# EAGLE design ライン_右 (EAGLE 9.6.2)
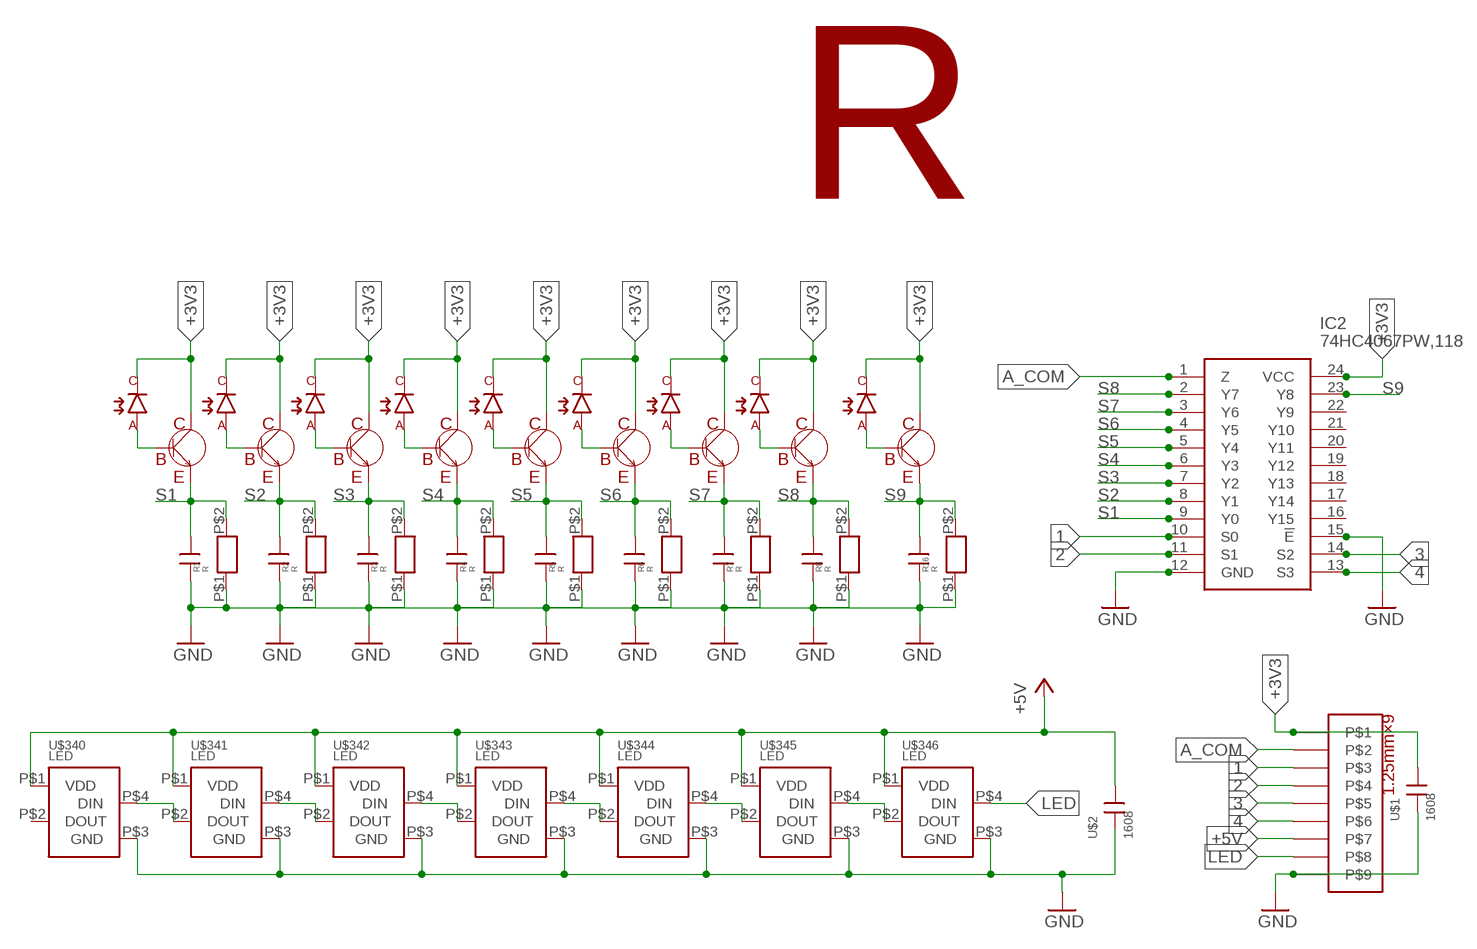
[diagram p0: schematic, sheet 1]

## Parts
C1  1608  [CON]
C2  1608  [CON]
C3  1608  [CON]
C4  1608  [CON]
C5  1608  [CON]
C6  1608  [CON]
C7  1608  [CON]
C8  1608  [CON]
C16  1608  [CON]
IC2  74HC4067PW,118  [SOP65P640X110-24N]
R1  R  [1608]
R2  R  [1608]
R3  R  [1608]
R4  R  [1608]
R5  R  [1608]
R6  R  [1608]
R7  R  [1608]
R8  R  [1608]
R16  R  [1608]
U$1  1608  [CON]
U$2  1608  [CON]
U$3  2CS2712  [TRANS_SSM3J325F,LF]
U$4  1MMCON  [1MMCON]
U$5  フォトダイオード  [フォトダイオード]
U$6  2CS2712  [TRANS_SSM3J325F,LF]
U$7  フォトダイオード  [フォトダイオード]
U$8  2CS2712  [TRANS_SSM3J325F,LF]
U$9  フォトダイオード  [フォトダイオード]
U$10  2CS2712  [TRANS_SSM3J325F,LF]
U$11  フォトダイオード  [フォトダイオード]
U$12  2CS2712  [TRANS_SSM3J325F,LF]
U$13  フォトダイオード  [フォトダイオード]
U$14  2CS2712  [TRANS_SSM3J325F,LF]
U$15  フォトダイオード  [フォトダイオード]
U$16  2CS2712  [TRANS_SSM3J325F,LF]
U$17  フォトダイオード  [フォトダイオード]
U$18  2CS2712  [TRANS_SSM3J325F,LF]
U$19  フォトダイオード  [フォトダイオード]
U$20  2CS2712  [TRANS_SSM3J325F,LF]
U$21  フォトダイオード  [フォトダイオード]
U$340  LED  [LED]
U$341  LED  [LED]
U$342  LED  [LED]
U$343  LED  [LED]
U$344  LED  [LED]
U$345  LED  [LED]
U$346  LED  [LED]

## Nets
1: IC2.10(S0) U$4.P$3
2: IC2.11(S1) U$4.P$4
3: IC2.14(S2) U$4.P$5
4: IC2.13(S3) U$4.P$6
+3V3 [New Class]: IC2.24(VCC) U$1.P$1 U$3.C U$4.P$1 U$5.C U$6.C U$7.C U$8.C U$9.C U$10.C U$11.C U$12.C U$13.C U$14.C U$15.C U$16.C U$17.C U$18.C U$19.C U$20.C U$21.C
+5V [New Class]: U$2.P$1 U$4.P$7 U$340.P$1(VDD) U$341.P$1(VDD) U$342.P$1(VDD) U$343.P$1(VDD) U$344.P$1(VDD) U$345.P$1(VDD) U$346.P$1(VDD)
A_COM: IC2.1(Z) U$4.P$2
GND [New Class]: C1.P$2 C2.P$2 C3.P$2 C4.P$2 C5.P$2 C6.P$2 C7.P$2 C8.P$2 C16.P$2 IC2.12(GND) IC2.15(!E) R1.P$1 R2.P$1 R3.P$1 R4.P$1 R5.P$1 R6.P$1 R7.P$1 R8.P$1 R16.P$1 U$1.P$2 U$2.P$2 U$4.P$9 U$340.P$3(GND) U$341.P$3(GND) U$342.P$3(GND) U$343.P$3(GND) U$344.P$3(GND) U$345.P$3(GND) U$346.P$3(GND)
LED: U$4.P$8 U$346.P$4(DIN)
N$1: U$3.B U$5.A
N$2: U$6.B U$7.A
N$3: U$8.B U$9.A
N$4: U$10.B U$11.A
N$5: U$12.B U$13.A
N$6: U$14.B U$15.A
N$7: U$16.B U$17.A
N$8: U$18.B U$19.A
N$9: U$20.B U$21.A
N$140: U$340.P$4(DIN) U$341.P$2(DOUT)
N$141: U$343.P$4(DIN) U$344.P$2(DOUT)
N$142: U$344.P$4(DIN) U$345.P$2(DOUT)
N$143: U$345.P$4(DIN) U$346.P$2(DOUT)
N$144: U$341.P$4(DIN) U$342.P$2(DOUT)
N$145: U$342.P$4(DIN) U$343.P$2(DOUT)
S1: C1.P$1 IC2.9(Y0) R1.P$2 U$3.E
S2: C2.P$1 IC2.8(Y1) R2.P$2 U$6.E
S3: C3.P$1 IC2.7(Y2) R3.P$2 U$8.E
S4: C4.P$1 IC2.6(Y3) R4.P$2 U$10.E
S5: C5.P$1 IC2.5(Y4) R5.P$2 U$12.E
S6: C6.P$1 IC2.4(Y5) R6.P$2 U$14.E
S7: C7.P$1 IC2.3(Y6) R7.P$2 U$16.E
S8: C8.P$1 IC2.2(Y7) R8.P$2 U$18.E
S9: C16.P$1 IC2.23(Y8) R16.P$2 U$20.E
Unconnected: IC2.16(Y15) IC2.17(Y14) IC2.18(Y13) IC2.19(Y12) IC2.20(Y11) IC2.21(Y10) IC2.22(Y9) U$340.P$2(DOUT)

## Notes on the sheet
- R

## Library data of the parts
C1-C8 C16 U$1 U$2 = con1608:1608
IC2 = 16ch MUX:74HC4067PW,118: 74HC(T)4067 - 16-channel analog multiplexer/demultiplexer@en-us Source: Datasheet <https://assets.nexperia.com/documents/data-sheet/74HC_HCT4067.pdf>; DESCRIPTION: 74HC(T)4067 - 16-channel analog multiplexer/demultiplexer@en-us; HEIGHT: 1.1mm; MANUFACTURER_NAME: Nexperia; MANUFACTURER_PART_NUMBER: 74HC4067PW,118; MOUSER_PART_NUMBER: 771-74HC4067PW-T; MOUSER_PRICE-STOCK: https://www.mouser.co.uk/ProductDetail/Nexperia/74HC4067PW118?qs=P62ublwmbi9BArRi%252BuDUjA%3D%3D
R1-R8 R16 = R 1608:R
U$3 U$6 U$8 U$10 U$12 U$14 U$16 U$18 U$20 = 2CS2712:2CS2712
U$4 = 9P_1.25mmCON:1MMCON
U$5 U$7 U$9 U$11 U$13 U$15 U$17 U$19 U$21 = フォトダイオード:フォトダイオード
U$340-U$346 = フルカラーLED:LED

## Net classes
1 New Class: width 0.229 mm

## Board
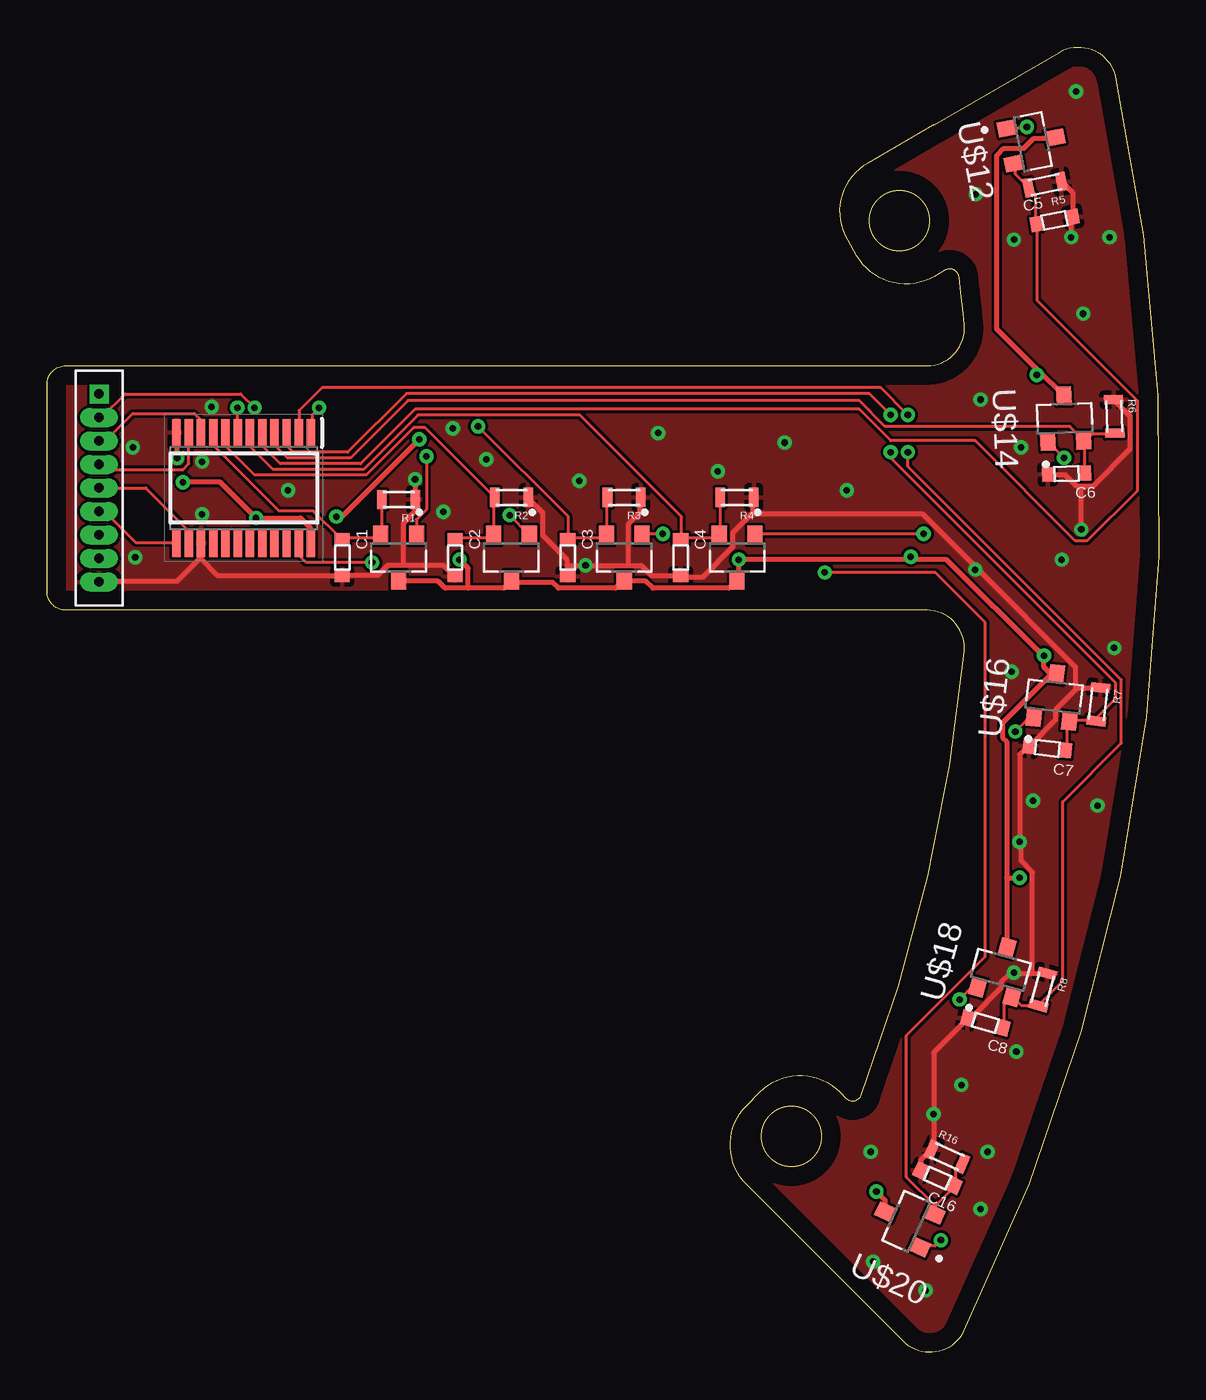
[diagram p1: board, top side]
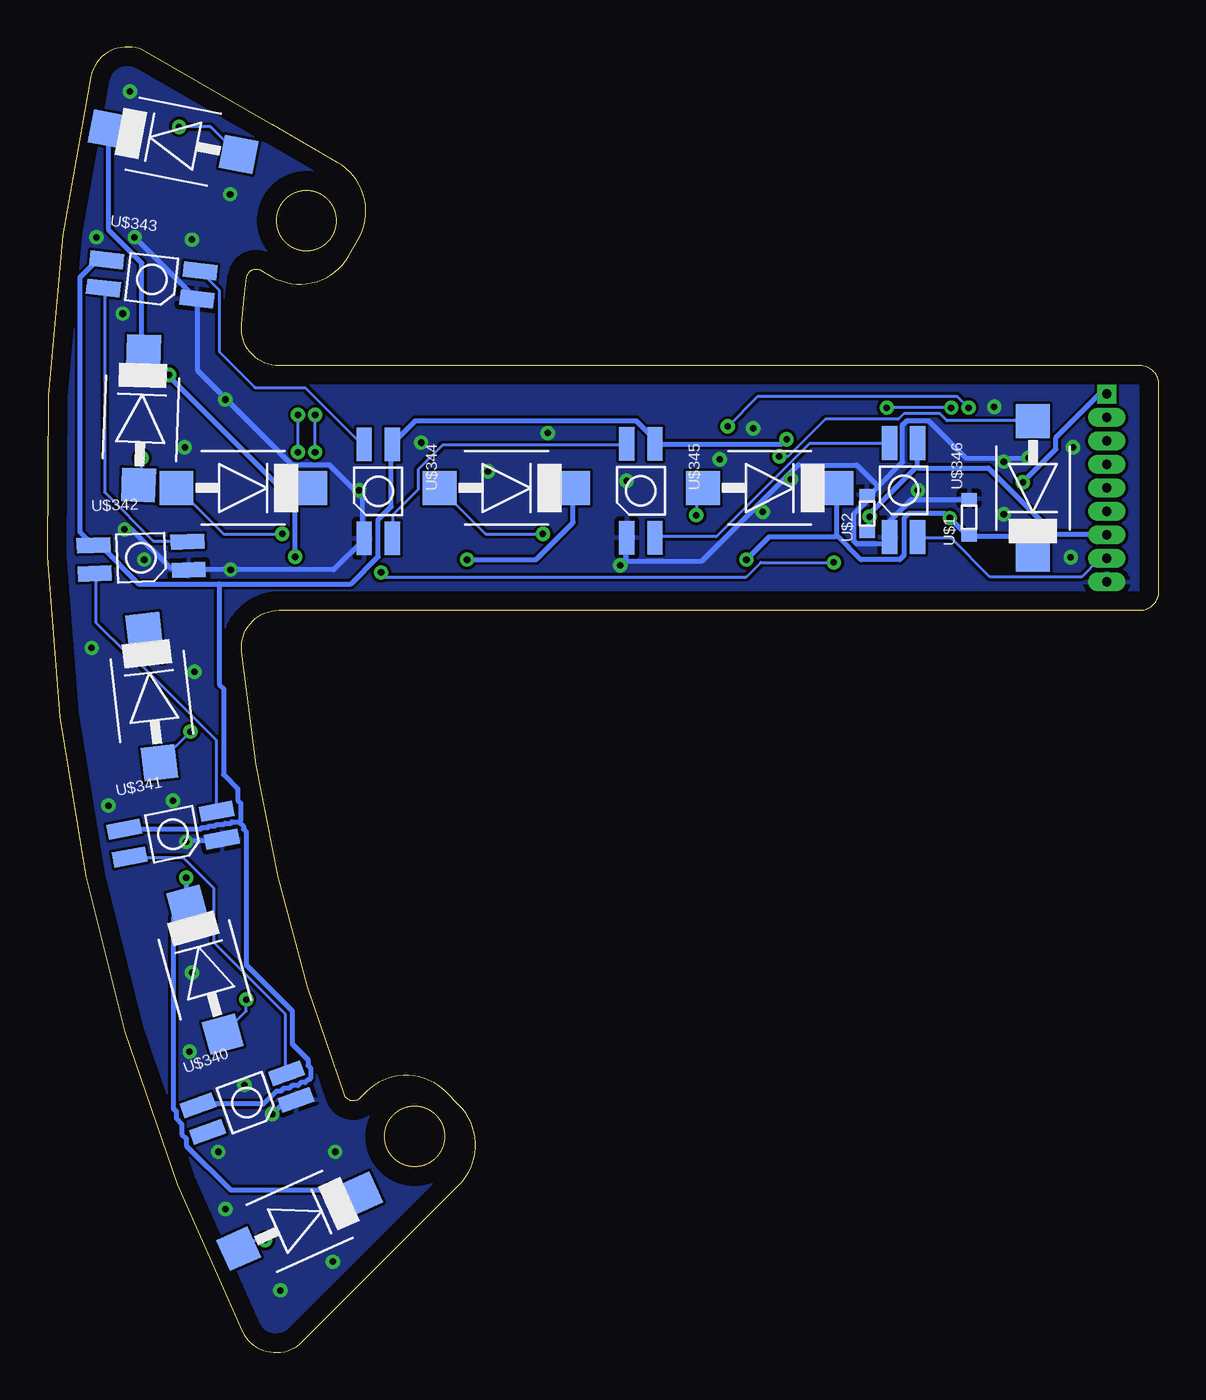
[diagram p2: board, bottom side, seen from below]

Size 59.13 x 69.43 mm. Coordinates in mm from the lower left corner, seen from the top.
Outline: 47.14,65.28 arc0 47.14,65.28 53.86,69.16 arc-108 56.81,67.86 arc-39 48.75,1.12 arc-109 45.54,0.59 37.21,8.91 arc-90 37.21,13.15 37.92,13.86 arc-90 42.16,13.86 42.5,13.52 arc114 43.32,13.7 arc15 48.79,37.29 arc95 46.8,39.48 1,39.48 arc-90 0,40.48 0,51.48 arc-90 1,52.48 46.8,52.48 arc95 48.79,54.67 arc2 48.51,57.19 arc113 47.76,57.56 47.18,57.22 arc-90 43.08,58.32 42.58,59.18 arc-90 43.68,63.28 47.14,65.28
Outline: circle at 45.34,60.2 radius 1.6
Outline: circle at 39.58,11.49 radius 1.6
Copper layers (1*16): Top 0.035mm / dielectric 1.5mm / Bottom 0.035mm
Design rules "default": minimum track width 6mil, minimum drill 0.35mm, track to track 6mil, track to pad 6mil, pad to pad 6mil, via to via 6mil, smd to smd 6mil, copper to edge 40mil, drill to drill 6mil, minimum pad ring 10mil, minimum via ring 8mil, stop-mask expansion 4mil, vias tented up to drill 0mil, thermal gap 10mil

### Footprints (pad centres in the part's own frame; a part is rotated, then mirrored left to right if it is on the bottom)
CON = smd 0.6 x 0.813: P$1 -1,0; P$2 1,0
SOP65P640X110-24N = smd 1.475 x 0.45: 1 -2.938,3.575; 2 -2.938,2.925; 3 -2.938,2.275; 4 -2.938,1.625; 5 -2.938,0.975; 6 -2.938,0.325; 7 -2.938,-0.325; 8 -2.938,-0.975; 9 -2.938,-1.625; 10 -2.938,-2.275; 11 -2.938,-2.925; 12 -2.938,-3.575; 13 2.938,-3.575; 14 2.938,-2.925; 15 2.938,-2.275; 16 2.938,-1.625; 17 2.938,-0.975; 18 2.938,-0.325; 19 2.938,0.325; 20 2.938,0.975; 21 2.938,1.625; 22 2.938,2.275; 23 2.938,2.925; 24 2.938,3.575
1608 = smd 0.508 x 1.016: P$1 -0.889,0; P$2 0.889,0
TRANS_SSM3J325F,LF = smd 1 x 0.8: B -1.2,0.95; C 1.2,0; E -1.2,-0.95
1MMCON = drill 0.5 square: P$1 0,0 | drill 0.5 long: P$2 1.25,0; P$3 2.5,0; P$4 3.75,0; P$5 5,0; P$6 6.25,0; P$7 7.5,0; P$8 8.75,0; P$9 10,0
フォトダイオード = smd 1.8 x 1.8: A -3.55,0; C 3.55,0
LED = smd 1.8 x 0.82: P$1 -2.5,0.75; P$2 -2.5,-0.75; P$3 2.5,-0.75; P$4 2.5,0.75

### Placement (x,y rotation side)
C1  15.7,42.28 270 top
C2  21.7,42.28 270 top
C3  27.7,42.28 270 top
C4  33.7,42.28 270 top
C5  53.59,60.2 11 top
C6  54.22,46.74 182.2 top
C7  53.2,32.13 173.4 top
C8  49.9,17.53 164.6 top
C16  47.36,9.27 155.8 top
IC2  10.47,45.98 270 top
R1  18.7,45.35 180 top
R2  24.7,45.48 180 top
R3  30.7,45.48 180 top
R4  36.7,45.48 180 top
R5  53.08,62.11 191 top
R6  56.76,49.79 272.2 top
R7  55.91,34.47 263.4 top
R8  52.95,19.31 254.6 top
R16  47.87,10.42 335.8 top
U$1  10.09,44.42 90 bottom
U$2  15.52,44.62 90 bottom
U$3  18.7,42.28 270 top
U$4  2.77,50.98 270 top
U$5  6.7,45.98 270 bottom
U$6  24.7,42.28 270 top
U$7  20.7,45.98 0 bottom
U$8  30.7,42.28 270 top
U$9  34.7,45.98 0 bottom
U$10  36.7,42.28 270 top
U$11  48.7,45.98 0 bottom
U$12  52.43,64.39 11 top
U$13  52.43,64.39 169 bottom
U$14  54.13,49.68 92.2 top
U$15  54.13,49.68 87.8 bottom
U$16  53.56,34.89 83.4 top
U$17  53.56,34.89 96.6 bottom
U$18  50.74,20.35 74.6 top
U$19  50.74,20.35 105.4 bottom
U$20  45.7,6.98 155.8 top
U$21  45.7,6.98 24.2 bottom
U$340  48.49,13.29 19.8 bottom
U$341  52.43,27.56 11 bottom
U$342  54.13,42.27 2.2 bottom
U$343  53.56,57.07 353.4 bottom
U$344  41.52,45.8 270 bottom
U$345  27.55,45.83 270 bottom
U$346  13.58,45.86 270 bottom

### Tracks (layer width: path | path; a pad name or v marks a point on that pad's centre or on a via)
1
  Top 0.152: IC2.10 8.14,48.95 8.14,49.64 7.84,49.94 4.56,49.94 3.12,48.49 2.81,48.49 U$4.P$3
2
  Top 0.152: IC2.11 7.54,48.87 7.54,47.27 7.23,46.97 3.04,46.97 2.81,47.2 U$4.P$4
3
  Top 0.152: U$4.P$5 5.25,45.98 7.54,43.69 7.54,43.08 IC2.14
4
  Top 0.152: IC2.13 6.85,43.08 4.72,43.08 3.12,44.68 2.81,44.68 U$4.P$6
+3V3  (via drill 0.35)
  Top 0.254: 52.8,52.15 54.02,50.93 U$14.C | 52.8,52.15 50.51,54.44 50.51,63.66 50.89,64.04 51.96,64.04 52.49,64.57 53.56,64.57 U$12.C | v52.64,52 52.8,52.15 | IC2.24 14.01,43.08 14.01,43.84 13.48,44.38 v11.12,44.38 9.21,46.28 v7.23,46.28 | 22.39,40.64 24.3,40.64 24.68,41.02 U$6.C 24.76,40.95 26.89,40.95 27.19,40.64 30.24,40.64 30.62,41.02 U$8.C 30.78,41.02 31.84,41.02 32.22,40.64 36.26,40.64 36.64,41.02 U$10.C 36.8,41.1 v36.8,42.17 45.94,42.17 | 22.39,40.64 21.18,40.64 20.79,41.02 18.74,41.02 U$3.C | v44.11,8.56 44.57,8.11 44.57,7.5 U$20.C | 51.05,25.25 51.05,32.49 50.82,32.72 50.82,33.48 53.41,36.07 53.64,36.07 U$16.C 53.33,36.15 53.03,36.45 v53.03,37.06 52.95,37.06 47.84,42.17 45.94,42.17 | 51.05,25.25 U$18.C | 51.05,25.25 v51.73,25.25 | v21.94,42.17 22.39,41.71 22.39,40.64 | v45.94,42.32 45.94,42.17
  Bottom 0.254: 52.68,51.96 53.94,53.22 U$15.C 54.09,53.29 54.09,57.94 55.85,59.69 55.85,65.03 U$13.C | 52.68,51.96 46.7,45.98 U$11.C 45.94,45.9 v45.94,42.32 | v52.64,52 52.68,51.96 | U$5.C 6.77,42.47 7.69,43.39 10.05,43.39 U$1.P$1 10.2,43.46 v11.12,44.38 11.35,44.61 13.33,44.61 13.55,44.38 13.55,42.4 13.78,42.17 15.84,42.17 17.14,43.46 | 17.14,43.46 17.14,45.98 U$7.C | v7.23,46.28 5.48,48.03 5.48,48.64 3.19,50.93 2.81,50.93 U$4.P$1 | v36.8,42.17 33.14,42.17 31.16,44.15 U$9.C | U$21.C 42.51,8.49 42.59,8.56 v44.11,8.56 44.19,8.64 49.37,8.64 51.73,11 51.73,11.38 51.96,11.61 51.96,12.14 52.26,12.45 52.26,12.83 52.42,12.98 52.42,23.12 51.81,23.73 U$19.C 51.73,23.8 v51.73,25.25 | v53.03,37.06 53.94,37.98 53.94,38.36 U$17.C | v21.94,42.17 20.72,43.39 17.21,43.39 17.14,43.46
+5V  (via drill 0.35)
  Top 0.254: v15.38,44.45 15.69,44.45 v19.8,48.57
  Bottom 0.254: 48.91,28.22 48.68,27.99 48.68,27.84 48.53,27.69 48.53,20.6 46.09,18.16 46.09,16.41 45.25,15.57 45.25,15.27 45.1,15.12 45.1,14.58 45.18,14.51 45.25,14.51 45.41,14.35 45.64,14.35 45.79,14.2 46.09,14.2 46.24,14.05 46.55,14.05 46.7,13.9 46.93,13.9 47.62,13.21 51.05,13.21 U$340.P$1 | 48.91,28.22 49.29,28.22 49.37,28.15 49.67,28.15 49.75,28.07 50.13,28.07 50.21,27.99 50.51,27.99 50.59,27.92 50.89,27.92 50.97,27.84 55.01,27.84 U$341.P$1 | 15.46,44.45 15.46,44.53 12.87,47.12 | 15.46,44.45 15.46,43.69 U$2.P$1 | 12.87,47.12 12.87,48.34 U$346.P$1 | U$4.P$7 2.81,43.54 5.55,43.54 9.06,47.04 12.79,47.04 12.87,47.12 | U$343.P$1 56,58.09 56.45,58.09 57.37,57.18 57.37,43.62 56.68,42.93 U$342.P$1 56.53,42.93 56.3,42.93 54.25,40.87 49.98,40.87 | 49.98,40.87 42.97,40.87 41.52,42.32 41.52,44.3 40.83,44.99 40.83,48.19 U$344.P$1 40.76,48.34 39.54,49.56 27.8,49.56 26.81,48.57 26.81,48.34 U$345.P$1 26.79,48.31 20.06,48.31 v19.8,48.57 | v15.38,44.45 15.46,44.45 | 49.98,40.87 49.98,35.54 49.75,35.31 49.75,30.74 48.99,29.98 48.99,29.37 48.84,29.21 48.84,28.3 48.91,28.22
A_COM  (via drill 0.35)
  Top 0.152: v14.47,50.24 14.09,49.86 14.09,48.95 IC2.1 | v11.04,50.24 10.3,50.98 4.16,50.98 2.96,49.79 2.81,49.79 U$4.P$2
  Bottom 0.152: v11.04,50.24 v14.47,50.24
GND  (via drill 0.35)
  Top 0.254: R5.P$1 54.02,62.21 54.55,61.67 54.55,60.46 C5.P$2 54.47,60.3 v54.47,59.31 | 55.01,46.05 55.62,46.05 57.6,48.03 57.6,49.79 56.76,50.63 R6.P$1 | 55.01,46.05 54.78,46.05 54.17,46.66 53.26,46.66 C6.P$2 | v55.01,43.77 55.01,46.05 | 54.78,35.31 53.64,34.17 53.64,33.63 52.26,32.26 C7.P$2 52.11,32.19 51.73,31.8 v51.73,27.16 51.81,27.08 51.81,26.17 52.42,25.56 52.42,20.15 | 54.78,35.31 56,35.31 R7.P$1 | C16.P$2 46.47,9.71 46.47,10.24 47.01,10.77 R16.P$1 47.16,10.85 v47.16,12.68 47.16,15.95 48.91,17.71 C8.P$2 48.99,17.86 49.22,17.86 50.74,19.38 50.74,19.69 51.2,20.15 52.42,20.15 | 52.42,20.15 53.18,20.15 R8.P$1 | 18.97,41.86 21.1,41.86 21.63,41.33 C2.P$2 | 18.97,41.86 18.13,41.86 17.59,41.33 15.76,41.33 C1.P$2 15.61,41.33 9.06,41.33 8.14,42.24 | 18.97,41.86 18.97,44.15 19.57,44.76 19.57,45.29 R1.P$1 19.57,45.44 v19.57,46.43 | 8.14,42.24 8.14,43.01 IC2.15 | 8.14,42.24 6.93,41.02 2.81,41.02 U$4.P$9 | v6.93,47.58 6.93,48.87 IC2.12 | 27.65,41.86 27.65,42.17 26.36,43.46 26.36,44.68 25.59,45.44 R2.P$1 | 27.65,41.86 27.65,41.33 C3.P$2 | 27.65,41.86 v28.64,41.86 30.93,41.86 | 30.93,41.86 31.61,41.86 32.15,41.33 33.67,41.33 C4.P$2 33.82,41.25 34.89,41.25 36.49,42.85 36.49,43.62 37.56,44.68 | 30.93,41.86 30.93,44.07 31.54,44.68 31.54,45.44 R3.P$1 | 37.56,44.68 37.56,45.44 R4.P$1 | 49.45,41.71 46.55,44.61 37.63,44.61 37.56,44.68 | 49.45,41.71 54.7,36.45 54.7,35.39 54.78,35.31 | v49.37,41.63 49.45,41.71
  Bottom 0.254: v54.47,59.31 51.2,56.04 U$343.P$3 51.12,55.96 51.12,52.23 46.09,47.2 44.11,47.2 42.36,45.44 42.36,43.39 U$344.P$3 42.28,43.23 43.88,41.63 v49.37,41.63 51.58,41.63 U$342.P$3 51.66,41.71 52.57,41.71 54.63,43.77 v55.01,43.77 | v51.73,27.16 51.66,27.23 49.9,27.23 U$341.P$3 | v47.16,12.68 46.47,13.36 45.94,13.36 U$340.P$3 | U$1.P$2 10.13,45.37 13.17,45.37 14.32,44.22 14.32,43.39 U$346.P$3 14.39,43.31 14.7,43.01 16.07,43.01 16.22,43.16 16.22,44.61 15.54,45.29 15.54,45.6 U$2.P$2 15.46,45.52 14.93,46.05 | v6.93,47.58 10.28,47.58 12.26,49.56 13.4,49.56 13.63,49.33 13.63,47.35 14.93,46.05 | 28.34,42.17 28.34,43.31 U$345.P$3 | v28.64,41.86 28.34,42.17 | 14.93,46.05 16.07,47.2 19.19,47.2 19.77,46.63 | 19.77,46.63 24.3,42.09 28.26,42.09 28.34,42.17 | 19.77,46.63 v19.57,46.43
  other vias: 35.68,46.87 39.23,48.39 42.54,45.85 21.07,44.71 12.82,45.85 8.25,44.58 4.69,42.29 4.56,48.14 8.25,47.37 8.75,50.3 23.36,47.5 28.31,46.36 32.5,48.9 53.97,42.17 56.76,37.47 51.3,36.2 51.81,48.14 49.65,50.68 55.11,55.25 51.43,59.19 56.51,59.31 54.73,67.06 49.39,61.6 55.87,29.09 52.44,29.34 51.43,20.2 51.55,16.01 48.63,14.23 50.03,10.67 49.65,7.62 46.73,3.31 43.93,4.83 43.81,10.67 21.58,49.15
  pour Top: -5.47,-4.82 66.92,-4.82 66.92,71.38 36.44,71.38 -5.47,71.38
  pour Bottom: -5.47,71.38 -5.47,-4.82 66.92,-4.82 66.92,71.38 -4.2,71.38
LED
  Bottom 0.152: U$346.P$4 12.79,43.31 11.04,43.31 8.98,41.25 4.11,41.25 3.19,42.17 2.81,42.17 U$4.P$8
N$1  (via drill 0.35)
  Top 0.152: v20.18,47.65 20.18,44.83 19.65,44.3 19.65,43.54 U$3.B
  Bottom 0.152: v20.18,47.65 19.73,47.65 17.75,49.64 13.86,49.64 13.55,49.94 11.65,49.94 11.27,49.56 6.77,49.56 U$5.A
N$2  (via drill 0.35)
  Top 0.152: v24.6,44.53 25.59,43.54 U$6.B
  Bottom 0.152: v24.6,44.53 24.6,45.67 24.3,45.98 U$7.A
N$3  (via drill 0.35)
  Top 0.152: v32.76,43.54 31.69,43.54 U$8.B
  Bottom 0.152: v32.76,43.54 35.81,43.54 U$9.A
N$4  (via drill 0.35)
  Top 0.152: v46.62,43.54 37.71,43.54 U$10.B
  Bottom 0.152: v46.62,43.54 49.75,43.54 52.19,45.98 U$11.A
N$5  (via drill 0.35)
  Top 0.152: v52.11,65.18 52.04,65.1 51.12,65.1 U$12.B
  Bottom 0.152: v52.11,65.18 50.44,65.18 48.99,63.73 U$13.A
N$6  (via drill 0.35)
  Top 0.152: v54.09,47.58 53.26,48.42 U$14.B
  Bottom 0.152: v54.09,47.58 54.09,46.36 54.25,46.21 U$15.A
N$7  (via drill 0.35)
  Top 0.152: v51.5,33.02 52.26,33.79 52.42,33.79 U$16.B
  Bottom 0.152: v51.5,33.02 53.1,31.42 U$17.A
N$8  (via drill 0.35)
  Top 0.152: v48.53,18.77 49.14,19.38 49.45,19.38 U$18.B
  Bottom 0.152: v48.53,18.77 48.53,18.16 49.75,16.95 U$19.A
N$9  (via drill 0.35)
  Top 0.152: v47.54,5.97 47.23,5.67 46.47,5.67 U$20.B
  Bottom 0.152: v47.54,5.97 48.53,5.97 48.91,5.59 U$21.A
N$140
  Bottom 0.152: U$340.P$4 46.47,14.89 46.47,18.01 50.28,21.82 50.28,24.72 51.88,26.32 54.7,26.32 U$341.P$2
N$141
  Bottom 0.152: U$344.P$2 42.28,48.34 42.43,48.34 45.41,51.31 48.07,51.31 49.98,53.22 49.98,56.49 50.97,57.48 U$343.P$4
N$142
  Bottom 0.152: U$344.P$4 40.76,43.31 40.76,44.53 39.39,45.9 39.39,46.97 38.09,48.26 28.34,48.26 U$345.P$2
N$143
  Bottom 0.152: U$345.P$4 26.74,43.39 23.54,43.39 18.58,48.34 14.39,48.34 U$346.P$2
N$144
  Bottom 0.152: U$341.P$4 50.13,28.83 50.13,32.57 54.7,37.14 54.86,37.14 56.53,38.81 56.53,41.41 U$342.P$2
N$145
  Bottom 0.152: U$342.P$4 51.73,43.16 53.48,43.16 56.07,45.75 56.07,56.57 U$343.P$2
S1
  Top 0.152: R1.P$2 17.82,45.29 17.82,43.54 U$3.E 17.75,43.46 17.59,43.31 15.76,43.31 C1.P$1 15.69,43.23 14.16,44.76 12.34,44.76 8.91,48.19 8.91,48.87 IC2.9
S2
  Top 0.152: C2.P$1 21.71,43.31 23.54,43.31 23.69,43.46 U$6.E 23.77,43.54 23.77,45.44 R2.P$2 23.77,45.52 20.11,49.18 19.5,49.18 16.98,46.66 11.04,46.66 9.52,48.19 9.52,48.87 IC2.8
S3  (via drill 0.35)
  Top 0.152: R3.P$2 29.78,45.44 29.78,43.54 U$8.E 29.71,43.46 29.56,43.31 27.73,43.31 C3.P$1 27.73,43.39 27.73,44.45 v22.93,49.25 | v10.13,50.24 10.13,48.95 IC2.7
  Bottom 0.152: v10.13,50.24 10.73,50.85 21.33,50.85 v22.93,49.25
S4
  Top 0.152: R4.P$2 35.81,45.44 35.81,43.54 U$10.E 35.73,43.46 35.58,43.31 33.75,43.31 C4.P$1 33.75,43.39 33.75,44.45 28.34,49.86 19.73,49.86 16.83,46.97 12.03,46.97 10.81,48.19 10.81,48.87 IC2.6
S5
  Top 0.152: U$12.E 51.5,63.2 51.5,62.67 52.19,61.98 R5.P$2 52.26,61.9 52.57,61.6 52.57,60.07 C5.P$1 52.64,60 52.64,55.96 57.98,50.63 57.98,45.83 55.31,43.16 54.7,43.16 49.37,48.49 44.87,48.49 43.2,50.17 19.57,50.17 16.68,47.27 12.41,47.27 11.5,48.19 11.5,48.87 IC2.5
S6
  Top 0.152: C6.P$1 55.16,46.82 55.16,48.49 U$14.E | R6.P$2 56.76,48.87 55.62,48.87 55.24,48.49 U$14.E | IC2.4 12.11,48.87 12.11,48.26 12.79,47.58 16.15,47.58 19.19,50.63 43.2,50.63 44.57,49.25 54.4,49.25 55.08,48.57 U$14.E
S7  (via drill 0.35)
  Top 0.152: C7.P$1 54.25,32.03 54.25,33.48 54.32,33.56 U$16.E 54.4,33.63 55.77,33.63 R7.P$2 55.77,33.71 56.84,34.78 56.84,35.61 44.87,47.58 v44.87,47.88 | v44.87,49.86 43.73,51.01 19.12,51.01 15.99,47.88 13.1,47.88 12.79,48.19 12.79,48.87 IC2.3
  Bottom 0.152: v44.87,47.88 v44.87,49.86
S8  (via drill 0.35)
  Top 0.152: C8.P$1 50.89,17.33 50.89,18.55 51.27,18.93 U$18.E 51.35,18.93 51.81,18.47 52.64,18.47 R8.P$2 52.72,18.47 54.02,19.76 54.02,29.29 57.14,32.41 57.14,35.77 45.79,47.12 v45.79,47.88 | v45.79,49.86 44.34,51.31 14.62,51.31 13.4,50.09 13.4,48.95 IC2.2
  Bottom 0.152: v45.79,47.88 v45.79,49.86
S9  (via drill 0.35)
  Top 0.152: R16.P$2 48.61,10.01 48.3,9.71 48.3,8.87 C16.P$1 48.23,8.79 47.23,7.8 | 47.23,7.8 47.23,7.42 U$20.E | v17.29,42.02 13.78,42.02 13.4,42.4 13.4,43.01 IC2.23 | v41.37,41.48 47.23,41.48 49.9,38.81 49.9,21.06 45.71,16.87 45.71,9.33 47.23,7.8
  Bottom 0.152: v17.29,42.02 21.18,42.02 21.94,41.25 41.14,41.25 v41.37,41.48